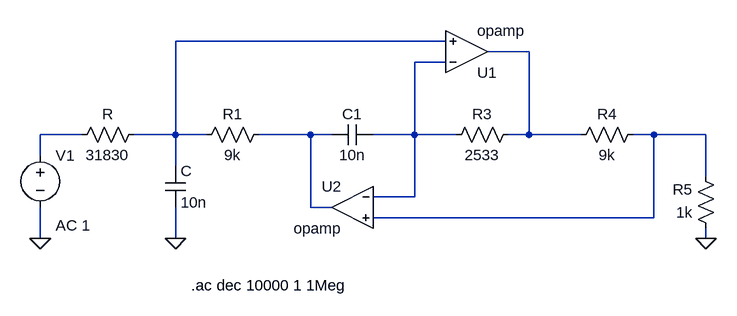
[diagram p0: schematic SEMANAL1.asc]
SEMANAL1.asc, the LTspice schematic file:
Version 4
SHEET 1 880 680
WIRE 368 32 -48 32
WIRE 496 48 432 48
WIRE 368 64 320 64
WIRE -192 176 -256 176
WIRE -48 176 -48 32
WIRE -48 176 -112 176
WIRE 0 176 -48 176
WIRE 160 176 80 176
WIRE 192 176 160 176
WIRE 320 176 320 64
WIRE 320 176 256 176
WIRE 384 176 320 176
WIRE 496 176 496 48
WIRE 496 176 464 176
WIRE 576 176 496 176
WIRE 688 176 656 176
WIRE 768 176 688 176
WIRE -256 208 -256 176
WIRE -48 224 -48 176
WIRE 768 240 768 176
WIRE 320 272 320 176
WIRE 320 272 256 272
WIRE 160 288 160 176
WIRE 192 288 160 288
WIRE 688 304 688 176
WIRE 688 304 256 304
WIRE -256 336 -256 288
WIRE -48 336 -48 288
WIRE 768 336 768 320
FLAG 768 336 0
FLAG -48 336 0
FLAG -256 336 0
SYMBOL opamp 400 112 M180
SYMATTR InstName U1
SYMBOL cap 256 160 R90
WINDOW 0 0 32 VBottom 2
WINDOW 3 32 32 VTop 2
SYMATTR InstName C1
SYMATTR Value 10n
SYMBOL voltage -256 192 R0
WINDOW 123 24 124 Left 2
WINDOW 39 0 0 Left 0
SYMATTR InstName V1
SYMATTR Value ""
SYMATTR Value2 AC 1
SYMBOL res -96 160 R90
WINDOW 0 0 56 VBottom 2
WINDOW 3 32 56 VTop 2
SYMATTR InstName R
SYMATTR Value 31830
SYMBOL res 96 160 R90
WINDOW 0 0 56 VBottom 2
WINDOW 3 32 56 VTop 2
SYMATTR InstName R1
SYMATTR Value 9k
SYMBOL res 480 160 R90
WINDOW 0 0 56 VBottom 2
WINDOW 3 32 56 VTop 2
SYMATTR InstName R3
SYMATTR Value 2533
SYMBOL res 672 160 R90
WINDOW 0 0 56 VBottom 2
WINDOW 3 32 56 VTop 2
SYMATTR InstName R4
SYMATTR Value 9k
SYMBOL res 784 336 R180
WINDOW 0 36 76 Left 2
WINDOW 3 36 40 Left 2
SYMATTR InstName R5
SYMATTR Value 1k
SYMBOL cap -64 224 R0
SYMATTR InstName C
SYMATTR Value 10n
SYMBOL opamp 224 224 M0
SYMATTR InstName U2
TEXT -24 408 Left 2 !.ac dec 10000 1 1Meg

The netlist it stands for:
* SEMANAL1.asc
XU1 N003 N001 N002 opamp Aol=100K GBW=10Meg  ; pins invin noninvin out
C1 N003 N005 10n
V1 N004 0 AC 1
R N001 N004 31830
R1 N005 N001 9k
R3 N002 N003 2533
R4 N006 N002 9k
R5 0 N006 1k
C N001 0 10n
XU2 N003 N006 N005 opamp Aol=100K GBW=10Meg  ; pins invin noninvin out
.ac dec 10000 1 1Meg
.backanno
.end